# Altium schematic sheet hdmi power.SchDoc
size A4
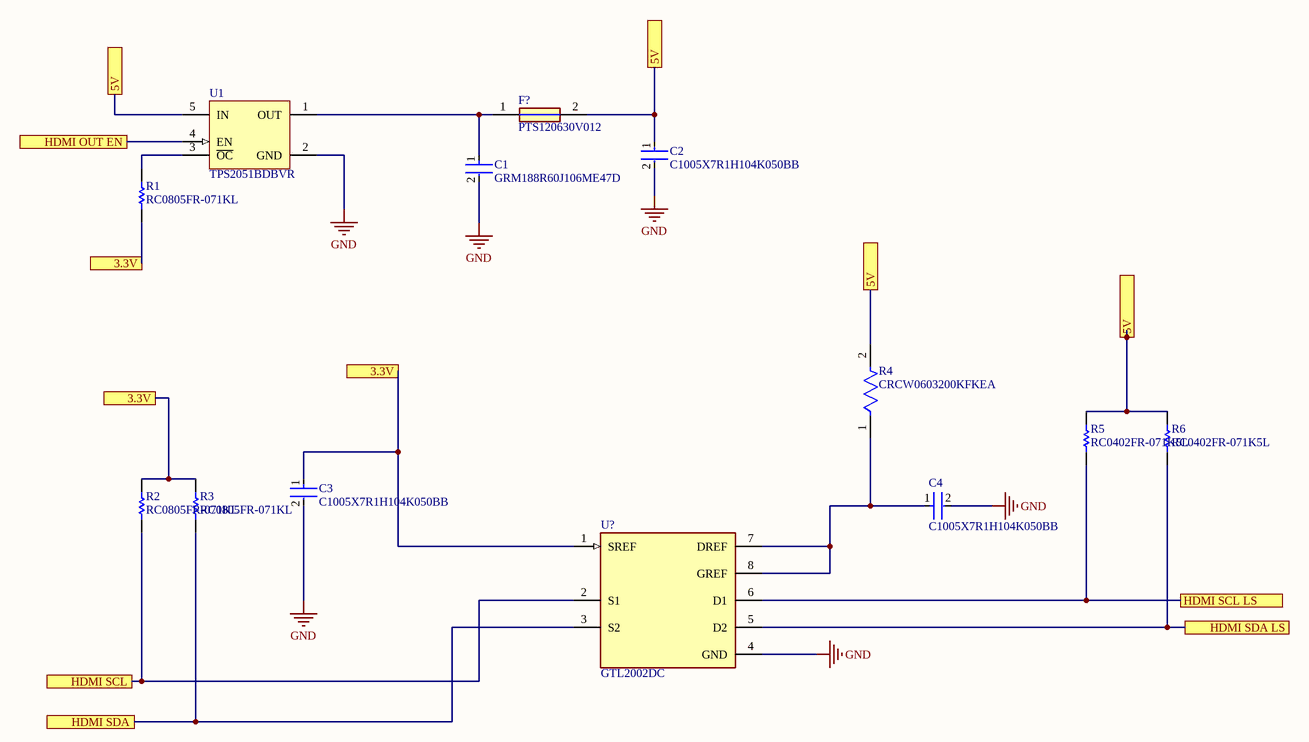
[diagram p0: hdmi power.SchDoc]

## Parts
C1  GRM188R60J106ME47D  [FP-GRM188-0_1-e0_2_0_55-IPC_A]
C2  C1005X7R1H104K050BB  [FP-C1005-050-0_05-IPC_C]
C3  C1005X7R1H104K050BB  [FP-C1005-050-0_05-IPC_C]
C4  C1005X7R1H104K050BB  [FP-C1005-050-0_05-IPC_C]
F?  PTS120630V012  [PTS120630V012]
R1  RC0805FR-071KL  [RESC2013X60X35ML10T20]
R2  RC0805FR-071KL  [RESC2013X60X35ML10T20]
R3  RC0805FR-071KL  [RESC2013X60X35ML10T20]
R4  CRCW0603200KFKEA  [FP-CRCW0603-e3-IPC_C]
R5  RC0402FR-071K5L  [RESC1005X40X25ML05T10]
R6  RC0402FR-071K5L  [RESC1005X40X25ML05T10]
U1  TPS2051BDBVR  [DBV0005A_L]
U?  GTL2002DC  [FP-SOT765-1-IPC_B]

## Ports
3.3V, 5V, HDMI OUT EN, HDMI SCL, HDMI SCL LS, HDMI SDA, HDMI SDA LS

## Nets
GND: C1.2 C2.2 C3.2 C4.2 U1.2(GND) U?.4(GND)
3.3V: C3.1 R1.1 R2.2 R3.2 U?.1(SREF) ; port 3.3V
5V: C2.1 F?.2 R4.2 R5.2 R6.2 U1.5(IN) ; port 5V
HDMI OUT EN: U1.4(EN) ; port HDMI OUT EN
HDMI SCL: R2.1 U?.2(S1) ; port HDMI SCL
HDMI SCL LS: R5.1 U?.6(D1) ; port HDMI SCL LS
HDMI SDA: R3.1 U?.3(S2) ; port HDMI SDA
HDMI SDA LS: R6.1 U?.5(D2) ; port HDMI SDA LS
NetC1_1: C1.1 F?.1 U1.1(OUT)
NetC4_1: C4.1 R4.1 U?.7(DREF) U?.8(GREF)
NetR1_2: R1.2 U1.3(~{OC})

## Library data of the parts
C1 = CMP-2006-02792-2: Chip Multilayer Ceramic Capacitors for General Purpose, 0603, 10uF, X5R, 15%, 20%, 6.3V; Packaging: Tape and Reel; Voltage Rating (DC): 6.3V; Width: 0.031inch; Termination: SMD/SMT; Dielectric: X5R; Package Quantity: 4000; Voltage Rating: 6.3V; Capacitance: 10uF; Case/Package: 0603; Min Operating Temperature: -55°C; Voltage: 6.3V; Length: 1.6mm; Thickness: 0.035inch; Lead Free: Lead Free; Depth: 0.8mm; Case Code (Imperial): 0603; Max Operating Temperature: 85°C; Material: Ceramic; Height: 0.8mm; Tolerance: 20%; Mount: Surface Mount; REACH SVHC: No SVHC; Radiation Hardening: No; Case Code (Metric): 1608
C2-C4 = CMP-2000-05393-2: Multilayer Ceramic Capacitors 100nF ±10% 50V X7R SMD 0402; Voltage: 50V; Dielectric Material: Ceramic; Min Operating Temperature: -55°C; Depth: 0.5mm; Radiation Hardening: No; RoHS Compliant: Yes; Voltage Rating (DC): 50V; Lead Free: Lead Free; Resistor Type: Ceramic; Height: 0.5mm; Dielectric: X7R; Thickness: 0.022inch; Case/Package: 0402; Case Code (Metric): 1005; Termination: SMD/SMT; Capacitance: 100nF; Packaging: Tape and Reel; Max Operating Temperature: 125°C; Mount: Surface Mount; Package Quantity: 1; Width: 0.02inch; Weight: 2.3E-05oz; Voltage Rating: 50V; Tolerance: 10%; Construction: Flat; Case Code (Imperial): 0402; Length: 1mm; REACH SVHC: No SVHC; Series: C
F? = PTS120630V012: Fuse; Manufacturer_Name: Eaton; Datasheet Link: https://componentsearchengine.com/Datasheets/2/PTS120630V012.pdf; Height: 0.9mm; Manufacturer_Part_Number: PTS120630V012; Mouser Part Number: 504-PTS120630V012; Mouser Price/Stock: https://www.mouser.co.uk/ProductDetail/Bussmann-Eaton/PTS120630V012?qs=QmibqUXyDhRHrC1SbxkW3w%3D%3D; Arrow Part Number: PTS120630V012; Arrow Price/Stock: https://www.arrow.com/en/products/pts120630v012/eaton?region=nac
R1-R3 = CMP-2100-03671-1: Chip Resistor, 1 KOhm, +/- 1%, 125 mW, -55 to 155 degC, 0805 (2012 Metric), RoHS, Tape and Reel; Manufacturer: Yageo; Temperature Coefficient: 100ppm/degreesC; Voltage Rating (DC): 150V; Max Power Dissipation: 125mW; Resistance: 1KOhm; Number of Pins: 2; Number of Terminations: 2; Datasheet URL: http://www.yageo.com/NewPortal/yageodocoutput?fileName=/pdf/R-Chip/PYu-RC_Group_51_RoHS_L_5.pdf; Length: 0.079inch; Package Description: 2-Pin Surface Mounted Device, Body 2 x 1.25 mm; Depth: 1.25mm; Height: 0.024inch; Military Standard: Not; Case/Package: 0805; Package Reference: 0805; RoHSCompliant: true; Lead Free: LeadFree; Packaging: TapeandReel; Package Quantity: 1; Datasheet Version: Rev. 5, 10/2016; Tolerance: 1%; Min Operating Temperature: -55degC; Voltage Rating: 150V; Composition: ThickFilm; Case Code (Imperial): 0805; Power Rating: 125mW; Width: 0.049inch; Case Code (Metric): 2012; Manufacturer URL: http://www.yageo.com/; Max Operating Temperature: 155degC; REACH SVHC: Unknown; Termination: SMD/SMT
R4 = CMP-2000-03059-2: RES Thick Film, 200kΩ, 1%, 0.1W, 100ppm/°C, 0603; Resistance: 200kR; Voltage Rating (DC): 75V; Power Rating: 100mW; Termination: SMD/SMT; Depth: 0.85mm; Military Standard: Not; Case Code (Metric): 1608; Composition: Thick Film; Package Quantity: 10; Width: 0.033inch; Voltage Rating: 75V; Features: Automotive AEC-Q200; Max Power Dissipation: 100mW; Height: 0.45mm; Mount: Surface Mount; Max Operating Temperature: 155°C; Weight: 7.1E-05oz; Lead Free: Lead Free; Length: 1.55mm; Radiation Hardening: No; Case/Package: 0603; Packaging: Tape and Reel; Contact Plating: Tin; Min Operating Temperature: -55°C; Working Voltage: 75V; Temperature Coefficient: 100ppm/°C; Case Code (Imperial): 0603; Tolerance: 1%; Number of Terminations: 2
R5 R6 = CMP-2002-07464-1: Manufacturer: Yageo / Phycomp; Part Number: RC0402FR-071K5L
U1 = CMP-2000-07277-1: Current-Limited, Power-Distribution Switch, 2.7 to 5.5 V, -40 to 85 degC, 5-Pin SOT-23 (DBV), Green (RoHS & no Sb/Br), Tape and Reel; Manufacturer: TexasInstruments; Number of Outputs: 1Output; Operating Supply Voltage: 2.7Vto5.5V; Supply Voltage - Min: 2.7V; Supply Voltage - Max: 5.5V; Current Limit: 1A; Development Kit: TPS2051BEVM; Output Current: 500mA; On Resistance - Max: 70mOhms; Package Version: 4073253-4/N, 12/2014; Mounting Technology: SurfaceMount; Packaging: Reel; Package / Case: SOT-23-5; Maximum Operating Temperature: +85C; Package Description: 5-Pin Small Outline Transistor, Body 2.9 x 1.6 mm, Pitch 0.95 mm; Type: HighSide; Product: USBCurrentLimitedPowerSwitches; Minimum Operating Temperature: -40C; Manufacturer URL: http://www.ti.com/; Factory Pack Quantity: 3000; Mounting Style: SMD/SMT; Brand: TexasInstruments; Package Reference: DBV5; Package URL: http://www.ti.com/lit/ml/mpds018l/mpds018l.pdf; Datasheet URL: http://www.ti.com/general/docs/lit/getliterature.tsp?genericPartNumber=TPS2051B&fileType=pdf; Product Category: PowerSwitchICs-PowerDistribution; Series: TPS2051B; Datasheet Version: Rev. L, 06/2011; RoHS: Details
U? = CMP-10125-000016-1: Translation - Voltage Levels XLATR 2BIT BI-DIREC OD; RoHS Compliant: Yes